# Altium schematic sheet ExtraADC.SchDoc: ExtraADC
size A4; Author: Joao Guimaraes; Organization: Altium Limited; Address1: L3, 12a Rodborough Rd; Address2: Frenchs Forest; Address3: NSW; Address4: Australia 2086; Revision: 1.0.0
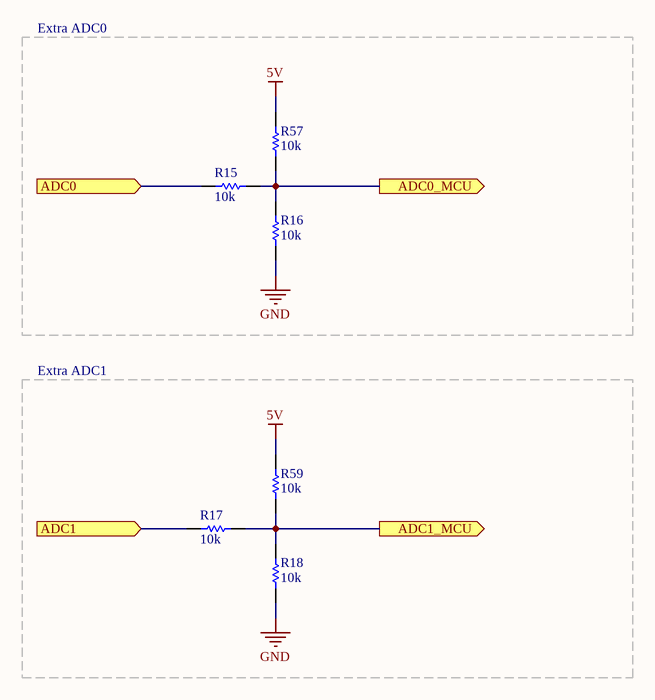
[diagram p0: ExtraADC.SchDoc]

## Parts
R15  10k  [6-0805_M]
R16  10k  [6-0805_M]
R17  10k  [6-0805_M]
R18  10k  [6-0805_M]
R57  10k  [6-0805_M]
R59  10k  [6-0805_M]

## Blocks framed on the sheet
Extra ADC0: R15 R16 R57
Extra ADC1: R17 R18 R59

## Ports
ADC0 (in), ADC0_MCU (out), ADC1 (in), ADC1_MCU (out)

## Nets
5V: R57.2 R59.2
GND: R16.1 R18.1
ADC0: R15.1 ; port ADC0
ADC0_MCU: R15.2 R16.2 R57.1 ; port ADC0_MCU
ADC1: R17.2 ; port ADC1
ADC1_MCU: R17.1 R18.2 R59.1 ; port ADC1_MCU

## Notes on the sheet
- Title:
- Project:
- Date:
- Author:
- Version:
- File:

## Library data of the parts
R15-R18 R57 R59 = Res: Resistor; PartNumber: RES.10k.1/8W.5%.SMD.0805; Manufacturer: Yageo; ClassName: PowerSupplies; Price: 0.013; Supplier: Mouser